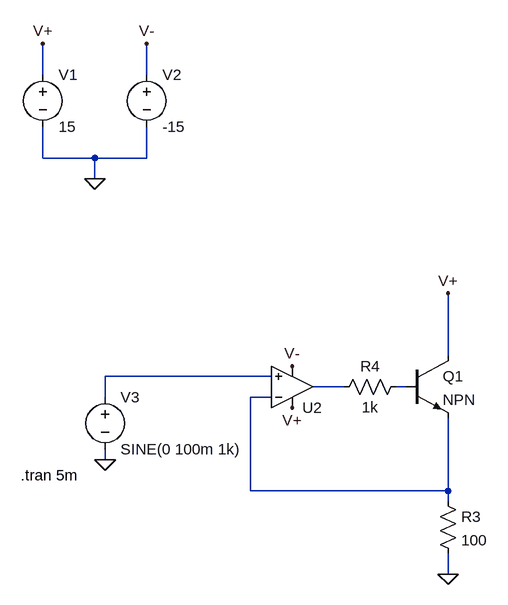
[diagram p0: schematic power_op.asc]
power_op.asc, the LTspice schematic file:
Version 4
SHEET 1 880 680
WIRE -96 -336 -96 -384
WIRE 64 -336 64 -384
WIRE -96 -208 -96 -256
WIRE -16 -208 -96 -208
WIRE 64 -208 64 -256
WIRE 64 -208 -16 -208
WIRE -16 -176 -16 -208
WIRE 528 96 528 0
WIRE 256 128 0 128
WIRE 368 144 320 144
WIRE 464 144 448 144
WIRE 0 160 0 128
WIRE 256 160 224 160
WIRE 0 256 0 240
WIRE 224 304 224 160
WIRE 528 304 528 192
WIRE 528 304 224 304
WIRE 528 320 528 304
WIRE 528 432 528 400
FLAG -16 -176 0
FLAG -96 -384 V+
FLAG 64 -384 V-
FLAG 288 176 V+
FLAG 288 112 V-
FLAG 0 256 0
FLAG 528 432 0
FLAG 528 0 V+
SYMBOL voltage -96 -352 R0
WINDOW 123 0 0 Left 2
WINDOW 39 0 0 Left 2
SYMATTR InstName V1
SYMATTR Value 15
SYMBOL voltage 64 -352 R0
WINDOW 123 0 0 Left 2
WINDOW 39 0 0 Left 2
SYMATTR InstName V2
SYMATTR Value -15
SYMBOL voltage 0 144 R0
WINDOW 123 0 0 Left 2
WINDOW 39 0 0 Left 2
SYMATTR InstName V3
SYMATTR Value SINE(0 100m 1k)
SYMBOL Opamps\\UniversalOpamp2 288 144 M180
SYMATTR InstName U2
SYMBOL npn 464 96 R0
SYMATTR InstName Q1
SYMBOL res 512 304 R0
SYMATTR InstName R3
SYMATTR Value 100
SYMBOL res 464 128 R90
WINDOW 0 0 56 VBottom 2
WINDOW 3 32 56 VTop 2
SYMATTR InstName R4
SYMATTR Value 1k
TEXT -130 280 Left 2 !.tran 5m

The netlist it stands for:
* power_op.asc
V1 V+ 0 15
V2 V- 0 -15
V3 N001 0 SINE(0 100m 1k)
XU2 N001 N004 V+ V- N002 level.2 Avol=1Meg GBW=10Meg Slew=10Meg ilimit=25m rail=0 Vos=0 phimargin=45 en=0 enk=0 in=0 ink=0 Rin=500Meg  ; pins IN+ IN- V+ V- OUT
Q1 V+ N003 N004 0 NPN
R3 N004 0 100
R4 N003 N002 1k
.model NPN NPN
.model PNP PNP
.lib standard.bjt
.tran 5m
.lib UniversalOpamps2.sub
.backanno
.end